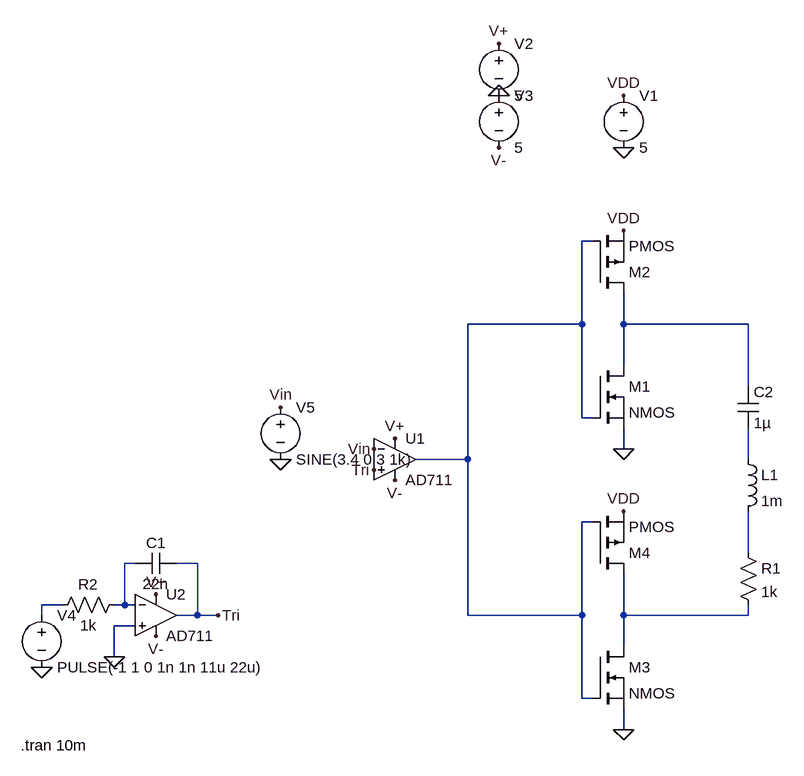
[diagram p0: schematic ClassDAmp.asc]
ClassDAmp.asc, the LTspice schematic file:
Version 4
SHEET 1 880 776
WIRE 240 -16 224 -16
WIRE 224 112 224 -16
WIRE 224 112 48 112
WIRE 288 112 288 64
WIRE 480 112 288 112
WIRE 288 176 288 112
WIRE 480 208 480 112
WIRE 224 256 224 112
WIRE 240 256 224 256
WIRE 288 304 288 272
WIRE 48 320 48 112
WIRE 48 320 -32 320
WIRE 480 320 480 272
WIRE 240 416 224 416
WIRE 480 464 480 400
WIRE -464 480 -480 480
WIRE -368 480 -400 480
WIRE -576 544 -608 544
WIRE -480 544 -480 480
WIRE -480 544 -496 544
WIRE -464 544 -480 544
WIRE -608 560 -608 544
WIRE -368 560 -368 480
WIRE -368 560 -400 560
WIRE -336 560 -368 560
WIRE 48 560 48 320
WIRE 224 560 224 416
WIRE 224 560 48 560
WIRE 288 560 288 496
WIRE 480 560 480 544
WIRE 480 560 288 560
WIRE -464 576 -496 576
WIRE 288 608 288 560
WIRE -496 624 -496 576
WIRE 224 688 224 560
WIRE 240 688 224 688
WIRE 288 736 288 704
FLAG 288 304 0
FLAG 288 736 0
FLAG 288 -32 VDD
FLAG 288 400 VDD
FLAG 288 -160 0
FLAG 288 -240 VDD
FLAG 96 -240 0
FLAG 96 -320 V+
FLAG -64 288 V+
FLAG 96 -160 V-
FLAG -64 352 V-
FLAG -240 320 0
FLAG -240 240 Vin
FLAG -96 304 Vin
FLAG -608 640 0
FLAG -432 528 V+
FLAG -432 592 V-
FLAG -496 624 0
FLAG -336 560 Tri
FLAG -96 336 Tri
SYMBOL nmos 240 176 R0
SYMATTR InstName M1
SYMBOL pmos 240 64 M180
SYMATTR InstName M2
SYMBOL nmos 240 608 R0
SYMATTR InstName M3
SYMBOL pmos 240 496 M180
SYMATTR InstName M4
SYMBOL voltage 288 -256 R0
WINDOW 123 0 0 Left 0
WINDOW 39 0 0 Left 0
SYMATTR InstName V1
SYMATTR Value 5
SYMBOL res 464 448 R0
SYMATTR InstName R1
SYMATTR Value 1k
SYMBOL OpAmps\\AD711 -64 256 R0
SYMATTR InstName U1
SYMBOL voltage 96 -336 R0
WINDOW 123 0 0 Left 0
WINDOW 39 0 0 Left 0
SYMATTR InstName V2
SYMATTR Value 5
SYMBOL voltage 96 -256 R0
WINDOW 123 0 0 Left 0
WINDOW 39 0 0 Left 0
SYMATTR InstName V3
SYMATTR Value 5
SYMBOL voltage -240 224 R0
WINDOW 123 0 0 Left 0
WINDOW 39 0 0 Left 0
SYMATTR InstName V5
SYMATTR Value SINE(3.4 0.3 1k)
SYMBOL voltage -608 544 R0
WINDOW 123 0 0 Left 0
WINDOW 39 0 0 Left 0
SYMATTR InstName V4
SYMATTR Value PULSE(-1 1 0 1n 1n 11u 22u)
SYMBOL OpAmps\\AD711 -432 496 R0
SYMATTR InstName U2
SYMBOL res -480 528 R90
WINDOW 0 0 56 VBottom 2
WINDOW 3 32 56 VTop 2
SYMATTR InstName R2
SYMATTR Value 1k
SYMBOL cap -400 464 R90
WINDOW 0 0 32 VBottom 2
WINDOW 3 32 32 VTop 2
SYMATTR InstName C1
SYMATTR Value 22n
SYMBOL cap 464 208 R0
SYMATTR InstName C2
SYMATTR Value 1µ
SYMBOL ind 464 304 R0
SYMATTR InstName L1
SYMATTR Value 1m
TEXT -640 760 Left 2 !.tran 10m

The netlist it stands for:
* ClassDAmp.asc
M1 N002 N001 0 0 NMOS
M2 N002 N001 VDD VDD PMOS
M3 N007 N001 0 0 NMOS
M4 N007 N001 VDD VDD PMOS
V1 VDD 0 5
R1 N004 N007 1k
XU1 Tri Vin V+ V- N001 AD712  ; AD711, pins In+ In- V+ V- OUT
V2 V+ 0 5
V3 0 V- 5
V5 Vin 0 SINE(3.4 0.3 1k)
V4 N006 0 PULSE(-1 1 0 1n 1n 11u 22u)
XU2 0 N005 V+ V- Tri AD712  ; AD711, pins In+ In- V+ V- OUT
R2 N005 N006 1k
C1 Tri N005 22n
C2 N002 N003 1µ
L1 N003 N004 1m
.model NMOS NMOS
.model PMOS PMOS
.lib standard.mos
.tran 10m
.lib ADI1.lib
.backanno
.end